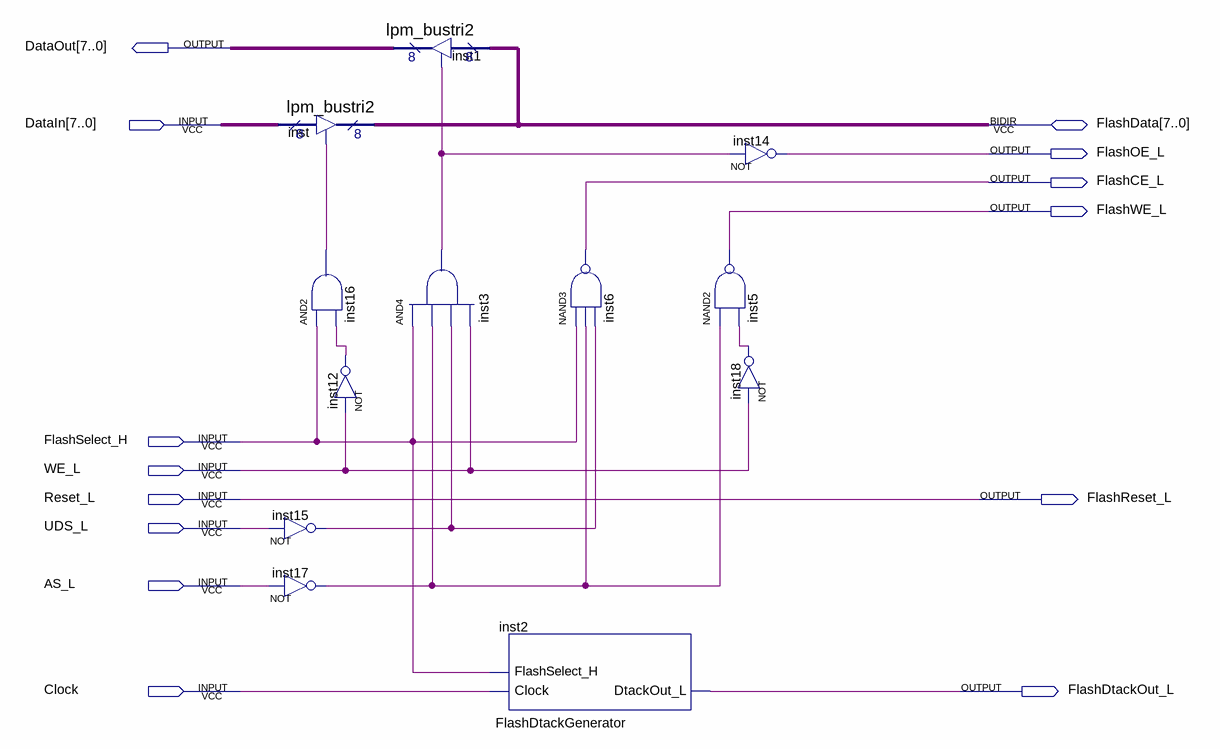
[diagram p0: schematic sheet]
// Quartus schematic FlashInterface_new.bdf as structural Verilog: 12 symbols, 14 pins
module FlashInterface_new (
  input  [7:0] DataIn,
  input  FlashSelect_H,
  input  WE_L,
  input  Reset_L,
  input  UDS_L,
  input  AS_L,
  input  Clock,
  inout  [7:0] FlashData,
  output [7:0] DataOut,
  output FlashOE_L,
  output FlashCE_L,
  output FlashWE_L,
  output FlashReset_L,
  output FlashDtackOut_L
);

  wire inst3_out, inst12_out, inst15_out, inst16_out, inst17_out, inst18_out;

  lpm_bustri2 inst (.enabledt(inst16_out), .data(DataIn), .tridata(FlashData));
  and inst16 (inst16_out, FlashSelect_H, inst12_out);
  not inst15 (inst15_out, UDS_L);
  not inst17 (inst17_out, AS_L);
  lpm_bustri2 inst1 (.enabledt(inst3_out), .data(FlashData), .tridata(DataOut));
  and inst3 (inst3_out, FlashSelect_H, inst17_out, inst15_out, WE_L);
  not inst12 (inst12_out, WE_L);
  FlashDtackGenerator inst2 (.Clock(Clock), .FlashSelect_H(FlashSelect_H), .DtackOut_L(FlashDtackOut_L));
  nand inst6 (FlashCE_L, FlashSelect_H, inst17_out, inst15_out);
  nand inst5 (FlashWE_L, inst17_out, inst18_out);
  not inst14 (FlashOE_L, inst3_out);
  not inst18 (inst18_out, WE_L);

  assign FlashReset_L = Reset_L;
endmodule
